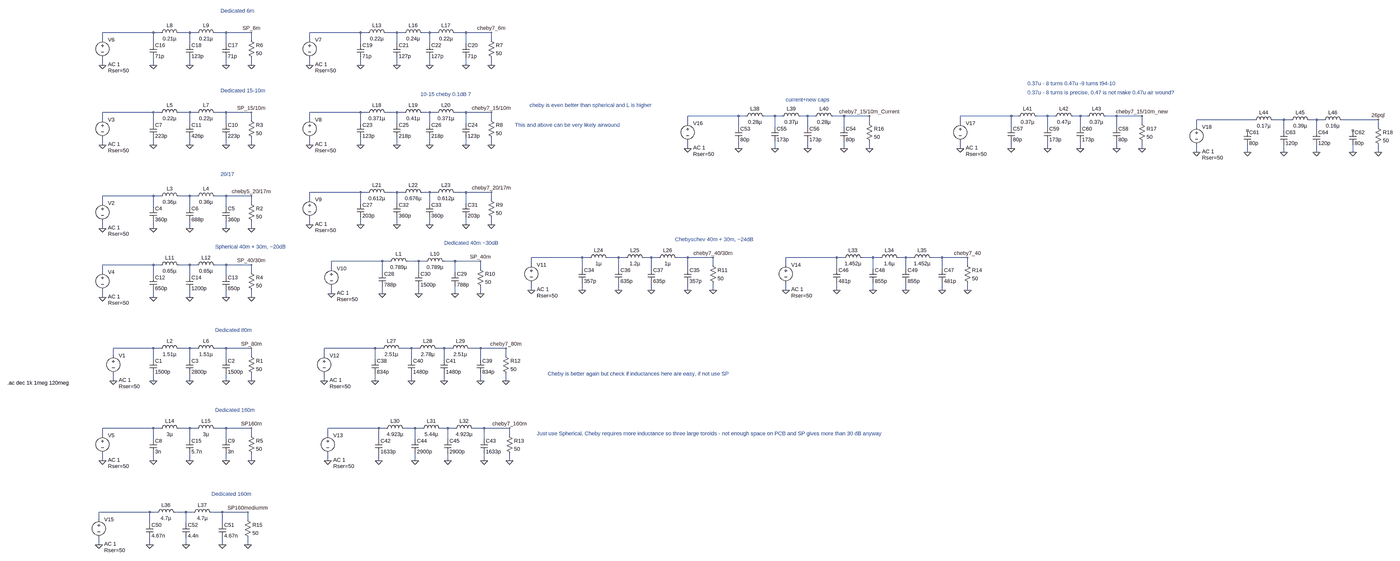
[diagram p0: schematic LPF.asc, whole sheet]
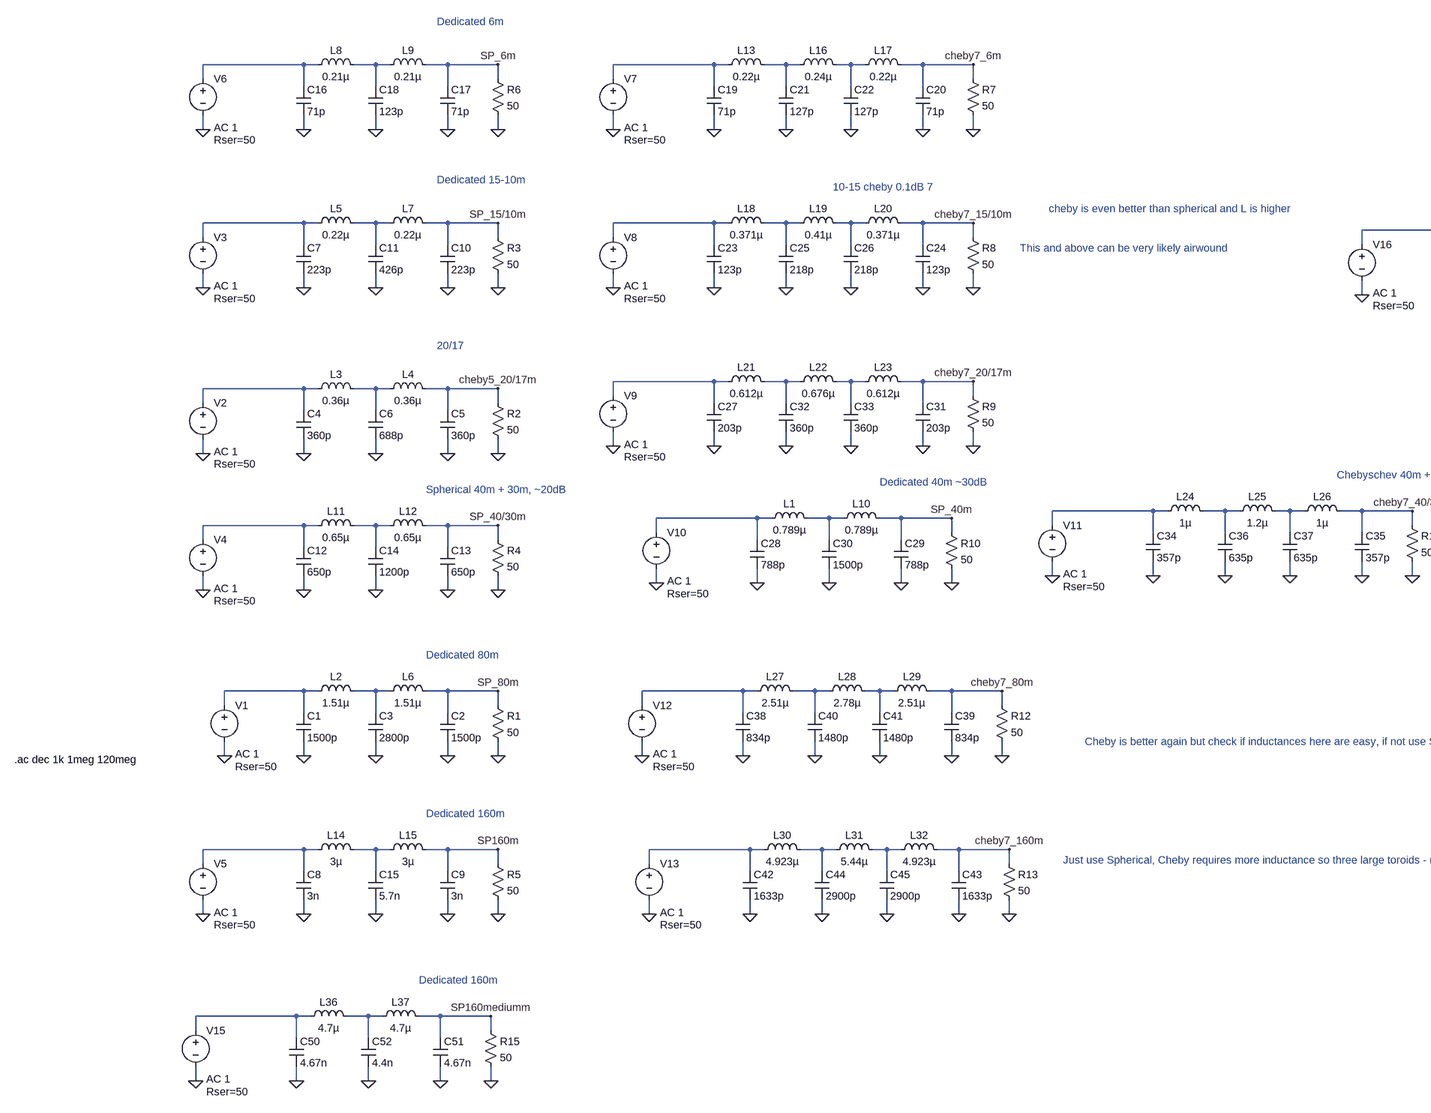
[diagram p1: schematic LPF.asc, part, row 1 of 1, column 1 of 2]
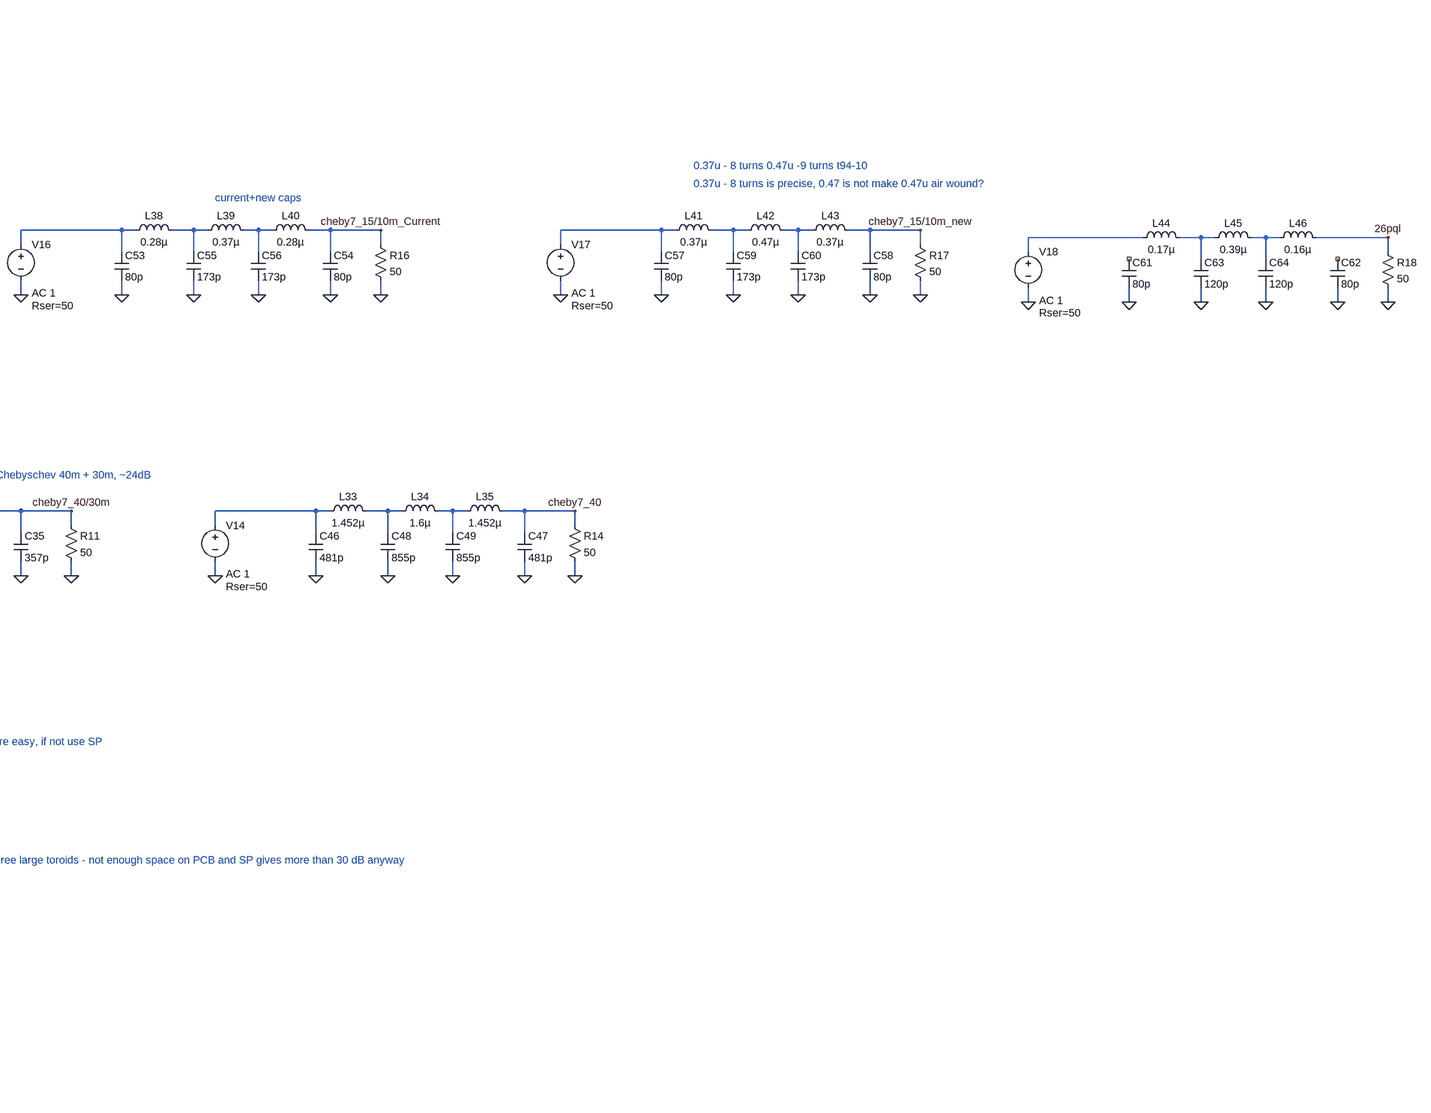
[diagram p2: schematic LPF.asc, part, row 1 of 1, column 2 of 2]
LPF.asc, the LTspice schematic file:
Version 4
SHEET 1 6016 728
WIRE 480 -1584 256 -1584
WIRE 512 -1584 480 -1584
WIRE 640 -1584 592 -1584
WIRE 672 -1584 640 -1584
WIRE 800 -1584 752 -1584
WIRE 912 -1584 800 -1584
WIRE 1392 -1584 1168 -1584
WIRE 1424 -1584 1392 -1584
WIRE 1552 -1584 1504 -1584
WIRE 1584 -1584 1552 -1584
WIRE 1696 -1584 1664 -1584
WIRE 1728 -1584 1696 -1584
WIRE 1856 -1584 1808 -1584
WIRE 1968 -1584 1856 -1584
WIRE 256 -1552 256 -1584
WIRE 912 -1552 912 -1584
WIRE 1168 -1552 1168 -1584
WIRE 1968 -1552 1968 -1584
WIRE 480 -1536 480 -1584
WIRE 640 -1536 640 -1584
WIRE 800 -1536 800 -1584
WIRE 1392 -1536 1392 -1584
WIRE 1552 -1536 1552 -1584
WIRE 1696 -1536 1696 -1584
WIRE 1856 -1536 1856 -1584
WIRE 256 -1440 256 -1472
WIRE 480 -1440 480 -1472
WIRE 640 -1440 640 -1472
WIRE 800 -1440 800 -1472
WIRE 912 -1440 912 -1472
WIRE 1168 -1440 1168 -1472
WIRE 1392 -1440 1392 -1472
WIRE 1552 -1440 1552 -1472
WIRE 1696 -1440 1696 -1472
WIRE 1856 -1440 1856 -1472
WIRE 1968 -1440 1968 -1472
WIRE 480 -1232 256 -1232
WIRE 512 -1232 480 -1232
WIRE 640 -1232 592 -1232
WIRE 672 -1232 640 -1232
WIRE 800 -1232 752 -1232
WIRE 912 -1232 800 -1232
WIRE 1392 -1232 1168 -1232
WIRE 1424 -1232 1392 -1232
WIRE 1552 -1232 1504 -1232
WIRE 1584 -1232 1552 -1232
WIRE 1696 -1232 1664 -1232
WIRE 1728 -1232 1696 -1232
WIRE 1856 -1232 1808 -1232
WIRE 1968 -1232 1856 -1232
WIRE 3056 -1216 2832 -1216
WIRE 3088 -1216 3056 -1216
WIRE 3216 -1216 3168 -1216
WIRE 3248 -1216 3216 -1216
WIRE 3360 -1216 3328 -1216
WIRE 3392 -1216 3360 -1216
WIRE 3520 -1216 3472 -1216
WIRE 3632 -1216 3520 -1216
WIRE 4256 -1216 4032 -1216
WIRE 4288 -1216 4256 -1216
WIRE 4416 -1216 4368 -1216
WIRE 4448 -1216 4416 -1216
WIRE 4560 -1216 4528 -1216
WIRE 4592 -1216 4560 -1216
WIRE 4720 -1216 4672 -1216
WIRE 4832 -1216 4720 -1216
WIRE 256 -1200 256 -1232
WIRE 912 -1200 912 -1232
WIRE 1168 -1200 1168 -1232
WIRE 1968 -1200 1968 -1232
WIRE 5328 -1200 5072 -1200
WIRE 5456 -1200 5408 -1200
WIRE 5488 -1200 5456 -1200
WIRE 5600 -1200 5568 -1200
WIRE 5632 -1200 5600 -1200
WIRE 5872 -1200 5712 -1200
WIRE 480 -1184 480 -1232
WIRE 640 -1184 640 -1232
WIRE 800 -1184 800 -1232
WIRE 1392 -1184 1392 -1232
WIRE 1552 -1184 1552 -1232
WIRE 1696 -1184 1696 -1232
WIRE 1856 -1184 1856 -1232
WIRE 2832 -1184 2832 -1216
WIRE 3632 -1184 3632 -1216
WIRE 4032 -1184 4032 -1216
WIRE 4832 -1184 4832 -1216
WIRE 3056 -1168 3056 -1216
WIRE 3216 -1168 3216 -1216
WIRE 3360 -1168 3360 -1216
WIRE 3520 -1168 3520 -1216
WIRE 4256 -1168 4256 -1216
WIRE 4416 -1168 4416 -1216
WIRE 4560 -1168 4560 -1216
WIRE 4720 -1168 4720 -1216
WIRE 5072 -1168 5072 -1200
WIRE 5872 -1168 5872 -1200
WIRE 5456 -1152 5456 -1200
WIRE 5600 -1152 5600 -1200
WIRE 256 -1088 256 -1120
WIRE 480 -1088 480 -1120
WIRE 640 -1088 640 -1120
WIRE 800 -1088 800 -1120
WIRE 912 -1088 912 -1120
WIRE 1168 -1088 1168 -1120
WIRE 1392 -1088 1392 -1120
WIRE 1552 -1088 1552 -1120
WIRE 1696 -1088 1696 -1120
WIRE 1856 -1088 1856 -1120
WIRE 1968 -1088 1968 -1120
WIRE 2832 -1072 2832 -1104
WIRE 3056 -1072 3056 -1104
WIRE 3216 -1072 3216 -1104
WIRE 3360 -1072 3360 -1104
WIRE 3520 -1072 3520 -1104
WIRE 3632 -1072 3632 -1104
WIRE 4032 -1072 4032 -1104
WIRE 4256 -1072 4256 -1104
WIRE 4416 -1072 4416 -1104
WIRE 4560 -1072 4560 -1104
WIRE 4720 -1072 4720 -1104
WIRE 4832 -1072 4832 -1104
WIRE 5072 -1056 5072 -1088
WIRE 5296 -1056 5296 -1088
WIRE 5456 -1056 5456 -1088
WIRE 5600 -1056 5600 -1088
WIRE 5760 -1056 5760 -1088
WIRE 5872 -1056 5872 -1088
WIRE 1392 -880 1168 -880
WIRE 1424 -880 1392 -880
WIRE 1552 -880 1504 -880
WIRE 1584 -880 1552 -880
WIRE 1696 -880 1664 -880
WIRE 1728 -880 1696 -880
WIRE 1856 -880 1808 -880
WIRE 1968 -880 1856 -880
WIRE 480 -864 256 -864
WIRE 512 -864 480 -864
WIRE 640 -864 592 -864
WIRE 672 -864 640 -864
WIRE 800 -864 752 -864
WIRE 912 -864 800 -864
WIRE 1168 -848 1168 -880
WIRE 1968 -848 1968 -880
WIRE 256 -832 256 -864
WIRE 912 -832 912 -864
WIRE 1392 -832 1392 -880
WIRE 1552 -832 1552 -880
WIRE 1696 -832 1696 -880
WIRE 1856 -832 1856 -880
WIRE 480 -816 480 -864
WIRE 640 -816 640 -864
WIRE 800 -816 800 -864
WIRE 1168 -736 1168 -768
WIRE 1392 -736 1392 -768
WIRE 1552 -736 1552 -768
WIRE 1696 -736 1696 -768
WIRE 1856 -736 1856 -768
WIRE 1968 -736 1968 -768
WIRE 256 -720 256 -752
WIRE 480 -720 480 -752
WIRE 640 -720 640 -752
WIRE 800 -720 800 -752
WIRE 912 -720 912 -752
WIRE 2368 -592 2144 -592
WIRE 2400 -592 2368 -592
WIRE 2528 -592 2480 -592
WIRE 2560 -592 2528 -592
WIRE 2672 -592 2640 -592
WIRE 2704 -592 2672 -592
WIRE 2832 -592 2784 -592
WIRE 2944 -592 2832 -592
WIRE 3488 -592 3264 -592
WIRE 3520 -592 3488 -592
WIRE 3648 -592 3600 -592
WIRE 3680 -592 3648 -592
WIRE 3792 -592 3760 -592
WIRE 3824 -592 3792 -592
WIRE 3952 -592 3904 -592
WIRE 4064 -592 3952 -592
WIRE 1488 -576 1264 -576
WIRE 1520 -576 1488 -576
WIRE 1648 -576 1600 -576
WIRE 1680 -576 1648 -576
WIRE 1808 -576 1760 -576
WIRE 1920 -576 1808 -576
WIRE 480 -560 256 -560
WIRE 512 -560 480 -560
WIRE 640 -560 592 -560
WIRE 672 -560 640 -560
WIRE 800 -560 752 -560
WIRE 912 -560 800 -560
WIRE 2144 -560 2144 -592
WIRE 2944 -560 2944 -592
WIRE 3264 -560 3264 -592
WIRE 4064 -560 4064 -592
WIRE 1264 -544 1264 -576
WIRE 1920 -544 1920 -576
WIRE 2368 -544 2368 -592
WIRE 2528 -544 2528 -592
WIRE 2672 -544 2672 -592
WIRE 2832 -544 2832 -592
WIRE 3488 -544 3488 -592
WIRE 3648 -544 3648 -592
WIRE 3792 -544 3792 -592
WIRE 3952 -544 3952 -592
WIRE 256 -528 256 -560
WIRE 912 -528 912 -560
WIRE 1488 -528 1488 -576
WIRE 1648 -528 1648 -576
WIRE 1808 -528 1808 -576
WIRE 480 -512 480 -560
WIRE 640 -512 640 -560
WIRE 800 -512 800 -560
WIRE 2144 -448 2144 -480
WIRE 2368 -448 2368 -480
WIRE 2528 -448 2528 -480
WIRE 2672 -448 2672 -480
WIRE 2832 -448 2832 -480
WIRE 2944 -448 2944 -480
WIRE 3264 -448 3264 -480
WIRE 3488 -448 3488 -480
WIRE 3648 -448 3648 -480
WIRE 3792 -448 3792 -480
WIRE 3952 -448 3952 -480
WIRE 4064 -448 4064 -480
WIRE 1264 -432 1264 -464
WIRE 1488 -432 1488 -464
WIRE 1648 -432 1648 -464
WIRE 1808 -432 1808 -464
WIRE 1920 -432 1920 -464
WIRE 256 -416 256 -448
WIRE 480 -416 480 -448
WIRE 640 -416 640 -448
WIRE 800 -416 800 -448
WIRE 912 -416 912 -448
WIRE 480 -192 304 -192
WIRE 512 -192 480 -192
WIRE 640 -192 592 -192
WIRE 672 -192 640 -192
WIRE 800 -192 752 -192
WIRE 912 -192 800 -192
WIRE 1456 -192 1232 -192
WIRE 1488 -192 1456 -192
WIRE 1616 -192 1568 -192
WIRE 1648 -192 1616 -192
WIRE 1760 -192 1728 -192
WIRE 1792 -192 1760 -192
WIRE 1920 -192 1872 -192
WIRE 2032 -192 1920 -192
WIRE 304 -160 304 -192
WIRE 912 -160 912 -192
WIRE 1232 -160 1232 -192
WIRE 2032 -160 2032 -192
WIRE 480 -144 480 -192
WIRE 640 -144 640 -192
WIRE 800 -144 800 -192
WIRE 1456 -144 1456 -192
WIRE 1616 -144 1616 -192
WIRE 1760 -144 1760 -192
WIRE 1920 -144 1920 -192
WIRE 304 -48 304 -80
WIRE 480 -48 480 -80
WIRE 640 -48 640 -80
WIRE 800 -48 800 -80
WIRE 912 -48 912 -80
WIRE 1232 -48 1232 -80
WIRE 1456 -48 1456 -80
WIRE 1616 -48 1616 -80
WIRE 1760 -48 1760 -80
WIRE 1920 -48 1920 -80
WIRE 2032 -48 2032 -80
WIRE 480 160 256 160
WIRE 512 160 480 160
WIRE 640 160 592 160
WIRE 672 160 640 160
WIRE 800 160 752 160
WIRE 912 160 800 160
WIRE 1472 160 1248 160
WIRE 1504 160 1472 160
WIRE 1632 160 1584 160
WIRE 1664 160 1632 160
WIRE 1776 160 1744 160
WIRE 1808 160 1776 160
WIRE 1936 160 1888 160
WIRE 2048 160 1936 160
WIRE 256 192 256 160
WIRE 912 192 912 160
WIRE 1248 192 1248 160
WIRE 2048 192 2048 160
WIRE 480 208 480 160
WIRE 640 208 640 160
WIRE 800 208 800 160
WIRE 1472 208 1472 160
WIRE 1632 208 1632 160
WIRE 1776 208 1776 160
WIRE 1936 208 1936 160
WIRE 256 304 256 272
WIRE 480 304 480 272
WIRE 640 304 640 272
WIRE 800 304 800 272
WIRE 912 304 912 272
WIRE 1248 304 1248 272
WIRE 1472 304 1472 272
WIRE 1632 304 1632 272
WIRE 1776 304 1776 272
WIRE 1936 304 1936 272
WIRE 2048 304 2048 272
WIRE 464 544 240 544
WIRE 496 544 464 544
WIRE 624 544 576 544
WIRE 656 544 624 544
WIRE 784 544 736 544
WIRE 896 544 784 544
WIRE 240 576 240 544
WIRE 896 576 896 544
WIRE 464 592 464 544
WIRE 624 592 624 544
WIRE 784 592 784 544
WIRE 240 688 240 656
WIRE 464 688 464 656
WIRE 624 688 624 656
WIRE 784 688 784 656
WIRE 896 688 896 656
FLAG 912 -416 0
FLAG 800 -416 0
FLAG 480 -416 0
FLAG 256 -416 0
FLAG 640 -416 0
FLAG 912 -560 SP_40/30m
FLAG 912 -48 0
FLAG 800 -48 0
FLAG 480 -48 0
FLAG 304 -48 0
FLAG 640 -48 0
FLAG 912 -192 SP_80m
FLAG 912 304 0
FLAG 800 304 0
FLAG 480 304 0
FLAG 256 304 0
FLAG 640 304 0
FLAG 912 160 SP160m
FLAG 1920 -432 0
FLAG 1808 -432 0
FLAG 1488 -432 0
FLAG 1264 -432 0
FLAG 1648 -432 0
FLAG 1920 -576 SP_40m
FLAG 912 -720 0
FLAG 800 -720 0
FLAG 480 -720 0
FLAG 256 -720 0
FLAG 640 -720 0
FLAG 912 -864 cheby5_20/17m
FLAG 912 -1088 0
FLAG 800 -1088 0
FLAG 480 -1088 0
FLAG 256 -1088 0
FLAG 640 -1088 0
FLAG 912 -1232 SP_15/10m
FLAG 912 -1440 0
FLAG 800 -1440 0
FLAG 480 -1440 0
FLAG 256 -1440 0
FLAG 640 -1440 0
FLAG 912 -1584 SP_6m
FLAG 1968 -1440 0
FLAG 1856 -1440 0
FLAG 1392 -1440 0
FLAG 1168 -1440 0
FLAG 1552 -1440 0
FLAG 1968 -1584 cheby7_6m
FLAG 1696 -1440 0
FLAG 1968 -1088 0
FLAG 1856 -1088 0
FLAG 1392 -1088 0
FLAG 1168 -1088 0
FLAG 1552 -1088 0
FLAG 1968 -1232 cheby7_15/10m
FLAG 1696 -1088 0
FLAG 1968 -736 0
FLAG 1856 -736 0
FLAG 1392 -736 0
FLAG 1168 -736 0
FLAG 1552 -736 0
FLAG 1968 -880 cheby7_20/17m
FLAG 1696 -736 0
FLAG 2944 -448 0
FLAG 2832 -448 0
FLAG 2368 -448 0
FLAG 2144 -448 0
FLAG 2528 -448 0
FLAG 2944 -592 cheby7_40/30m
FLAG 2672 -448 0
FLAG 2032 -48 0
FLAG 1920 -48 0
FLAG 1456 -48 0
FLAG 1232 -48 0
FLAG 1616 -48 0
FLAG 2032 -192 cheby7_80m
FLAG 1760 -48 0
FLAG 2048 304 0
FLAG 1936 304 0
FLAG 1472 304 0
FLAG 1248 304 0
FLAG 1632 304 0
FLAG 2048 160 cheby7_160m
FLAG 1776 304 0
FLAG 4064 -448 0
FLAG 3952 -448 0
FLAG 3488 -448 0
FLAG 3264 -448 0
FLAG 3648 -448 0
FLAG 4064 -592 cheby7_40
FLAG 3792 -448 0
FLAG 896 688 0
FLAG 784 688 0
FLAG 464 688 0
FLAG 240 688 0
FLAG 624 688 0
FLAG 896 544 SP160mediumm
FLAG 3632 -1072 0
FLAG 3520 -1072 0
FLAG 3056 -1072 0
FLAG 2832 -1072 0
FLAG 3216 -1072 0
FLAG 3632 -1216 cheby7_15/10m_Current
FLAG 3360 -1072 0
FLAG 4832 -1072 0
FLAG 4720 -1072 0
FLAG 4256 -1072 0
FLAG 4032 -1072 0
FLAG 4416 -1072 0
FLAG 4832 -1216 cheby7_15/10m_new
FLAG 4560 -1072 0
FLAG 5872 -1056 0
FLAG 5760 -1056 0
FLAG 5296 -1056 0
FLAG 5072 -1056 0
FLAG 5456 -1056 0
FLAG 5872 -1200 26pql
FLAG 5600 -1056 0
SYMBOL ind 496 -544 R270
WINDOW 0 32 56 VTop 2
WINDOW 3 5 56 VBottom 2
SYMATTR InstName L11
SYMATTR Value 0.65µ
SYMBOL cap 464 -512 R0
SYMATTR InstName C12
SYMATTR Value 650p
SYMBOL cap 784 -512 R0
SYMATTR InstName C13
SYMATTR Value 650p
SYMBOL res 896 -544 R0
SYMATTR InstName R4
SYMATTR Value 50
SYMBOL voltage 256 -544 R0
WINDOW 123 24 124 Left 2
WINDOW 39 24 152 Left 2
SYMATTR Value2 AC 1
SYMATTR SpiceLine Rser=50
SYMATTR InstName V4
SYMATTR Value ""
SYMBOL ind 656 -544 R270
WINDOW 0 32 56 VTop 2
WINDOW 3 5 56 VBottom 2
SYMATTR InstName L12
SYMATTR Value 0.65µ
SYMBOL cap 624 -512 R0
SYMATTR InstName C14
SYMATTR Value 1200p
SYMBOL ind 496 -176 R270
WINDOW 0 32 56 VTop 2
WINDOW 3 5 56 VBottom 2
SYMATTR InstName L2
SYMATTR Value 1.51µ
SYMBOL cap 464 -144 R0
SYMATTR InstName C1
SYMATTR Value 1500p
SYMBOL cap 784 -144 R0
SYMATTR InstName C2
SYMATTR Value 1500p
SYMBOL res 896 -176 R0
SYMATTR InstName R1
SYMATTR Value 50
SYMBOL voltage 304 -176 R0
WINDOW 123 24 124 Left 2
WINDOW 39 24 152 Left 2
SYMATTR Value2 AC 1
SYMATTR SpiceLine Rser=50
SYMATTR InstName V1
SYMATTR Value ""
SYMBOL ind 656 -176 R270
WINDOW 0 32 56 VTop 2
WINDOW 3 5 56 VBottom 2
SYMATTR InstName L6
SYMATTR Value 1.51µ
SYMBOL cap 624 -144 R0
SYMATTR InstName C3
SYMATTR Value 2800p
SYMBOL ind 496 176 R270
WINDOW 0 32 56 VTop 2
WINDOW 3 5 56 VBottom 2
SYMATTR InstName L14
SYMATTR Value 3µ
SYMATTR SpiceLine Rser=0.08
SYMBOL cap 464 208 R0
SYMATTR InstName C8
SYMATTR Value 3n
SYMBOL cap 784 208 R0
SYMATTR InstName C9
SYMATTR Value 3n
SYMBOL res 896 176 R0
SYMATTR InstName R5
SYMATTR Value 50
SYMBOL voltage 256 176 R0
WINDOW 123 24 124 Left 2
WINDOW 39 24 152 Left 2
SYMATTR Value2 AC 1
SYMATTR SpiceLine Rser=50
SYMATTR InstName V5
SYMATTR Value ""
SYMBOL ind 656 176 R270
WINDOW 0 32 56 VTop 2
WINDOW 3 5 56 VBottom 2
SYMATTR InstName L15
SYMATTR Value 3µ
SYMATTR SpiceLine Rser=0.08
SYMBOL cap 624 208 R0
SYMATTR InstName C15
SYMATTR Value 5.7n
SYMBOL ind 1504 -560 R270
WINDOW 0 32 56 VTop 2
WINDOW 3 5 56 VBottom 2
SYMATTR InstName L1
SYMATTR Value 0.789µ
SYMBOL cap 1472 -528 R0
SYMATTR InstName C28
SYMATTR Value 788p
SYMBOL cap 1792 -528 R0
SYMATTR InstName C29
SYMATTR Value 788p
SYMBOL res 1904 -560 R0
SYMATTR InstName R10
SYMATTR Value 50
SYMBOL voltage 1264 -560 R0
WINDOW 123 24 124 Left 2
WINDOW 39 24 152 Left 2
SYMATTR Value2 AC 1
SYMATTR SpiceLine Rser=50
SYMATTR InstName V10
SYMATTR Value ""
SYMBOL ind 1664 -560 R270
WINDOW 0 32 56 VTop 2
WINDOW 3 5 56 VBottom 2
SYMATTR InstName L10
SYMATTR Value 0.789µ
SYMBOL cap 1632 -528 R0
SYMATTR InstName C30
SYMATTR Value 1500p
SYMBOL ind 496 -848 R270
WINDOW 0 32 56 VTop 2
WINDOW 3 5 56 VBottom 2
SYMATTR InstName L3
SYMATTR Value 0.36µ
SYMBOL cap 464 -816 R0
SYMATTR InstName C4
SYMATTR Value 360p
SYMBOL cap 784 -816 R0
SYMATTR InstName C5
SYMATTR Value 360p
SYMBOL res 896 -848 R0
SYMATTR InstName R2
SYMATTR Value 50
SYMBOL voltage 256 -848 R0
WINDOW 123 24 124 Left 2
WINDOW 39 24 152 Left 2
SYMATTR Value2 AC 1
SYMATTR SpiceLine Rser=50
SYMATTR InstName V2
SYMATTR Value ""
SYMBOL ind 656 -848 R270
WINDOW 0 32 56 VTop 2
WINDOW 3 5 56 VBottom 2
SYMATTR InstName L4
SYMATTR Value 0.36µ
SYMBOL cap 624 -816 R0
SYMATTR InstName C6
SYMATTR Value 688p
SYMBOL ind 496 -1216 R270
WINDOW 0 32 56 VTop 2
WINDOW 3 5 56 VBottom 2
SYMATTR InstName L5
SYMATTR Value 0.22µ
SYMBOL cap 464 -1184 R0
SYMATTR InstName C7
SYMATTR Value 223p
SYMBOL cap 784 -1184 R0
SYMATTR InstName C10
SYMATTR Value 223p
SYMBOL res 896 -1216 R0
SYMATTR InstName R3
SYMATTR Value 50
SYMBOL voltage 256 -1216 R0
WINDOW 123 24 124 Left 2
WINDOW 39 24 152 Left 2
SYMATTR Value2 AC 1
SYMATTR SpiceLine Rser=50
SYMATTR InstName V3
SYMATTR Value ""
SYMBOL ind 656 -1216 R270
WINDOW 0 32 56 VTop 2
WINDOW 3 5 56 VBottom 2
SYMATTR InstName L7
SYMATTR Value 0.22µ
SYMBOL cap 624 -1184 R0
SYMATTR InstName C11
SYMATTR Value 426p
SYMBOL ind 496 -1568 R270
WINDOW 0 32 56 VTop 2
WINDOW 3 5 56 VBottom 2
SYMATTR InstName L8
SYMATTR Value 0.21µ
SYMBOL cap 464 -1536 R0
SYMATTR InstName C16
SYMATTR Value 71p
SYMBOL cap 784 -1536 R0
SYMATTR InstName C17
SYMATTR Value 71p
SYMBOL res 896 -1568 R0
SYMATTR InstName R6
SYMATTR Value 50
SYMBOL voltage 256 -1568 R0
WINDOW 123 24 124 Left 2
WINDOW 39 24 152 Left 2
SYMATTR Value2 AC 1
SYMATTR SpiceLine Rser=50
SYMATTR InstName V6
SYMATTR Value ""
SYMBOL ind 656 -1568 R270
WINDOW 0 32 56 VTop 2
WINDOW 3 5 56 VBottom 2
SYMATTR InstName L9
SYMATTR Value 0.21µ
SYMBOL cap 624 -1536 R0
SYMATTR InstName C18
SYMATTR Value 123p
SYMBOL ind 1408 -1568 R270
WINDOW 0 32 56 VTop 2
WINDOW 3 5 56 VBottom 2
SYMATTR InstName L13
SYMATTR Value 0.22µ
SYMBOL cap 1376 -1536 R0
SYMATTR InstName C19
SYMATTR Value 71p
SYMBOL cap 1840 -1536 R0
SYMATTR InstName C20
SYMATTR Value 71p
SYMBOL res 1952 -1568 R0
SYMATTR InstName R7
SYMATTR Value 50
SYMBOL voltage 1168 -1568 R0
WINDOW 123 24 124 Left 2
WINDOW 39 24 152 Left 2
SYMATTR Value2 AC 1
SYMATTR SpiceLine Rser=50
SYMATTR InstName V7
SYMATTR Value ""
SYMBOL ind 1568 -1568 R270
WINDOW 0 32 56 VTop 2
WINDOW 3 5 56 VBottom 2
SYMATTR InstName L16
SYMATTR Value 0.24µ
SYMBOL cap 1536 -1536 R0
SYMATTR InstName C21
SYMATTR Value 127p
SYMBOL ind 1712 -1568 R270
WINDOW 0 32 56 VTop 2
WINDOW 3 5 56 VBottom 2
SYMATTR InstName L17
SYMATTR Value 0.22µ
SYMBOL cap 1680 -1536 R0
SYMATTR InstName C22
SYMATTR Value 127p
SYMBOL ind 1408 -1216 R270
WINDOW 0 32 56 VTop 2
WINDOW 3 5 56 VBottom 2
SYMATTR InstName L18
SYMATTR Value 0.371µ
SYMBOL cap 1376 -1184 R0
SYMATTR InstName C23
SYMATTR Value 123p
SYMBOL cap 1840 -1184 R0
SYMATTR InstName C24
SYMATTR Value 123p
SYMBOL res 1952 -1216 R0
SYMATTR InstName R8
SYMATTR Value 50
SYMBOL voltage 1168 -1216 R0
WINDOW 123 24 124 Left 2
WINDOW 39 24 152 Left 2
SYMATTR Value2 AC 1
SYMATTR SpiceLine Rser=50
SYMATTR InstName V8
SYMATTR Value ""
SYMBOL ind 1568 -1216 R270
WINDOW 0 32 56 VTop 2
WINDOW 3 5 56 VBottom 2
SYMATTR InstName L19
SYMATTR Value 0.41µ
SYMBOL cap 1536 -1184 R0
SYMATTR InstName C25
SYMATTR Value 218p
SYMBOL ind 1712 -1216 R270
WINDOW 0 32 56 VTop 2
WINDOW 3 5 56 VBottom 2
SYMATTR InstName L20
SYMATTR Value 0.371µ
SYMBOL cap 1680 -1184 R0
SYMATTR InstName C26
SYMATTR Value 218p
SYMBOL ind 1408 -864 R270
WINDOW 0 32 56 VTop 2
WINDOW 3 5 56 VBottom 2
SYMATTR InstName L21
SYMATTR Value 0.612µ
SYMBOL cap 1376 -832 R0
SYMATTR InstName C27
SYMATTR Value 203p
SYMBOL cap 1840 -832 R0
SYMATTR InstName C31
SYMATTR Value 203p
SYMBOL res 1952 -864 R0
SYMATTR InstName R9
SYMATTR Value 50
SYMBOL voltage 1168 -864 R0
WINDOW 123 24 124 Left 2
WINDOW 39 24 152 Left 2
SYMATTR Value2 AC 1
SYMATTR SpiceLine Rser=50
SYMATTR InstName V9
SYMATTR Value ""
SYMBOL ind 1568 -864 R270
WINDOW 0 32 56 VTop 2
WINDOW 3 5 56 VBottom 2
SYMATTR InstName L22
SYMATTR Value 0.676µ
SYMBOL cap 1536 -832 R0
SYMATTR InstName C32
SYMATTR Value 360p
SYMBOL ind 1712 -864 R270
WINDOW 0 32 56 VTop 2
WINDOW 3 5 56 VBottom 2
SYMATTR InstName L23
SYMATTR Value 0.612µ
SYMBOL cap 1680 -832 R0
SYMATTR InstName C33
SYMATTR Value 360p
SYMBOL ind 2384 -576 R270
WINDOW 0 32 56 VTop 2
WINDOW 3 5 56 VBottom 2
SYMATTR InstName L24
SYMATTR Value 1µ
SYMBOL cap 2352 -544 R0
SYMATTR InstName C34
SYMATTR Value 357p
SYMBOL cap 2816 -544 R0
SYMATTR InstName C35
SYMATTR Value 357p
SYMBOL res 2928 -576 R0
SYMATTR InstName R11
SYMATTR Value 50
SYMBOL voltage 2144 -576 R0
WINDOW 123 24 124 Left 2
WINDOW 39 24 152 Left 2
SYMATTR Value2 AC 1
SYMATTR SpiceLine Rser=50
SYMATTR InstName V11
SYMATTR Value ""
SYMBOL ind 2544 -576 R270
WINDOW 0 32 56 VTop 2
WINDOW 3 5 56 VBottom 2
SYMATTR InstName L25
SYMATTR Value 1.2µ
SYMBOL cap 2512 -544 R0
SYMATTR InstName C36
SYMATTR Value 635p
SYMBOL ind 2688 -576 R270
WINDOW 0 32 56 VTop 2
WINDOW 3 5 56 VBottom 2
SYMATTR InstName L26
SYMATTR Value 1µ
SYMBOL cap 2656 -544 R0
SYMATTR InstName C37
SYMATTR Value 635p
SYMBOL ind 1472 -176 R270
WINDOW 0 32 56 VTop 2
WINDOW 3 5 56 VBottom 2
SYMATTR InstName L27
SYMATTR Value 2.51µ
SYMBOL cap 1440 -144 R0
SYMATTR InstName C38
SYMATTR Value 834p
SYMBOL cap 1904 -144 R0
SYMATTR InstName C39
SYMATTR Value 834p
SYMBOL res 2016 -176 R0
SYMATTR InstName R12
SYMATTR Value 50
SYMBOL voltage 1232 -176 R0
WINDOW 123 24 124 Left 2
WINDOW 39 24 152 Left 2
SYMATTR Value2 AC 1
SYMATTR SpiceLine Rser=50
SYMATTR InstName V12
SYMATTR Value ""
SYMBOL ind 1632 -176 R270
WINDOW 0 32 56 VTop 2
WINDOW 3 5 56 VBottom 2
SYMATTR InstName L28
SYMATTR Value 2.78µ
SYMBOL cap 1600 -144 R0
SYMATTR InstName C40
SYMATTR Value 1480p
SYMBOL ind 1776 -176 R270
WINDOW 0 32 56 VTop 2
WINDOW 3 5 56 VBottom 2
SYMATTR InstName L29
SYMATTR Value 2.51µ
SYMBOL cap 1744 -144 R0
SYMATTR InstName C41
SYMATTR Value 1480p
SYMBOL ind 1488 176 R270
WINDOW 0 32 56 VTop 2
WINDOW 3 5 56 VBottom 2
SYMATTR InstName L30
SYMATTR Value 4.923µ
SYMATTR SpiceLine Rser=0.08
SYMBOL cap 1456 208 R0
SYMATTR InstName C42
SYMATTR Value 1633p
SYMBOL cap 1920 208 R0
SYMATTR InstName C43
SYMATTR Value 1633p
SYMBOL res 2032 176 R0
SYMATTR InstName R13
SYMATTR Value 50
SYMBOL voltage 1248 176 R0
WINDOW 123 24 124 Left 2
WINDOW 39 24 152 Left 2
SYMATTR Value2 AC 1
SYMATTR SpiceLine Rser=50
SYMATTR InstName V13
SYMATTR Value ""
SYMBOL ind 1648 176 R270
WINDOW 0 32 56 VTop 2
WINDOW 3 5 56 VBottom 2
SYMATTR InstName L31
SYMATTR Value 5.44µ
SYMATTR SpiceLine Rser=0.08
SYMBOL cap 1616 208 R0
SYMATTR InstName C44
SYMATTR Value 2900p
SYMBOL ind 1792 176 R270
WINDOW 0 32 56 VTop 2
WINDOW 3 5 56 VBottom 2
SYMATTR InstName L32
SYMATTR Value 4.923µ
SYMATTR SpiceLine Rser=0.08
SYMBOL cap 1760 208 R0
SYMATTR InstName C45
SYMATTR Value 2900p
SYMBOL ind 3504 -576 R270
WINDOW 0 32 56 VTop 2
WINDOW 3 5 56 VBottom 2
SYMATTR InstName L33
SYMATTR Value 1.452µ
SYMBOL cap 3472 -544 R0
SYMATTR InstName C46
SYMATTR Value 481p
SYMBOL cap 3936 -544 R0
SYMATTR InstName C47
SYMATTR Value 481p
SYMBOL res 4048 -576 R0
SYMATTR InstName R14
SYMATTR Value 50
SYMBOL voltage 3264 -576 R0
WINDOW 123 24 124 Left 2
WINDOW 39 24 152 Left 2
SYMATTR Value2 AC 1
SYMATTR SpiceLine Rser=50
SYMATTR InstName V14
SYMATTR Value ""
SYMBOL ind 3664 -576 R270
WINDOW 0 32 56 VTop 2
WINDOW 3 5 56 VBottom 2
SYMATTR InstName L34
SYMATTR Value 1.6µ
SYMBOL cap 3632 -544 R0
SYMATTR InstName C48
SYMATTR Value 855p
SYMBOL ind 3808 -576 R270
WINDOW 0 32 56 VTop 2
WINDOW 3 5 56 VBottom 2
SYMATTR InstName L35
SYMATTR Value 1.452µ
SYMBOL cap 3776 -544 R0
SYMATTR InstName C49
SYMATTR Value 855p
SYMBOL ind 480 560 R270
WINDOW 0 32 56 VTop 2
WINDOW 3 5 56 VBottom 2
SYMATTR InstName L36
SYMATTR Value 4.7µ
SYMATTR SpiceLine Rser=0.08
SYMBOL cap 448 592 R0
SYMATTR InstName C50
SYMATTR Value 4.67n
SYMBOL cap 768 592 R0
SYMATTR InstName C51
SYMATTR Value 4.67n
SYMBOL res 880 560 R0
SYMATTR InstName R15
SYMATTR Value 50
SYMBOL voltage 240 560 R0
WINDOW 123 24 124 Left 2
WINDOW 39 24 152 Left 2
SYMATTR Value2 AC 1
SYMATTR SpiceLine Rser=50
SYMATTR InstName V15
SYMATTR Value ""
SYMBOL ind 640 560 R270
WINDOW 0 32 56 VTop 2
WINDOW 3 5 56 VBottom 2
SYMATTR InstName L37
SYMATTR Value 4.7µ
SYMATTR SpiceLine Rser=0.08
SYMBOL cap 608 592 R0
SYMATTR InstName C52
SYMATTR Value 4.4n
SYMBOL ind 3072 -1200 R270
WINDOW 0 32 56 VTop 2
WINDOW 3 5 56 VBottom 2
SYMATTR InstName L38
SYMATTR Value 0.28µ
SYMBOL cap 3040 -1168 R0
SYMATTR InstName C53
SYMATTR Value 80p
SYMBOL cap 3504 -1168 R0
SYMATTR InstName C54
SYMATTR Value 80p
SYMBOL res 3616 -1200 R0
SYMATTR InstName R16
SYMATTR Value 50
SYMBOL voltage 2832 -1200 R0
WINDOW 123 24 124 Left 2
WINDOW 39 24 152 Left 2
SYMATTR Value2 AC 1
SYMATTR SpiceLine Rser=50
SYMATTR InstName V16
SYMATTR Value ""
SYMBOL ind 3232 -1200 R270
WINDOW 0 32 56 VTop 2
WINDOW 3 5 56 VBottom 2
SYMATTR InstName L39
SYMATTR Value 0.37µ
SYMBOL cap 3200 -1168 R0
SYMATTR InstName C55
SYMATTR Value 173p
SYMBOL ind 3376 -1200 R270
WINDOW 0 32 56 VTop 2
WINDOW 3 5 56 VBottom 2
SYMATTR InstName L40
SYMATTR Value 0.28µ
SYMBOL cap 3344 -1168 R0
SYMATTR InstName C56
SYMATTR Value 173p
SYMBOL ind 4272 -1200 R270
WINDOW 0 32 56 VTop 2
WINDOW 3 5 56 VBottom 2
SYMATTR InstName L41
SYMATTR Value 0.37µ
SYMBOL cap 4240 -1168 R0
SYMATTR InstName C57
SYMATTR Value 80p
SYMBOL cap 4704 -1168 R0
SYMATTR InstName C58
SYMATTR Value 80p
SYMBOL res 4816 -1200 R0
SYMATTR InstName R17
SYMATTR Value 50
SYMBOL voltage 4032 -1200 R0
WINDOW 123 24 124 Left 2
WINDOW 39 24 152 Left 2
SYMATTR Value2 AC 1
SYMATTR SpiceLine Rser=50
SYMATTR InstName V17
SYMATTR Value ""
SYMBOL ind 4432 -1200 R270
WINDOW 0 32 56 VTop 2
WINDOW 3 5 56 VBottom 2
SYMATTR InstName L42
SYMATTR Value 0.47µ
SYMBOL cap 4400 -1168 R0
SYMATTR InstName C59
SYMATTR Value 173p
SYMBOL ind 4576 -1200 R270
WINDOW 0 32 56 VTop 2
WINDOW 3 5 56 VBottom 2
SYMATTR InstName L43
SYMATTR Value 0.37µ
SYMBOL cap 4544 -1168 R0
SYMATTR InstName C60
SYMATTR Value 173p
SYMBOL ind 5312 -1184 R270
WINDOW 0 32 56 VTop 2
WINDOW 3 5 56 VBottom 2
SYMATTR InstName L44
SYMATTR Value 0.17µ
SYMBOL cap 5280 -1152 R0
SYMATTR InstName C61
SYMATTR Value 80p
SYMBOL cap 5744 -1152 R0
SYMATTR InstName C62
SYMATTR Value 80p
SYMBOL res 5856 -1184 R0
SYMATTR InstName R18
SYMATTR Value 50
SYMBOL voltage 5072 -1184 R0
WINDOW 123 24 124 Left 2
WINDOW 39 24 152 Left 2
SYMATTR Value2 AC 1
SYMATTR SpiceLine Rser=50
SYMATTR InstName V18
SYMATTR Value ""
SYMBOL ind 5472 -1184 R270
WINDOW 0 32 56 VTop 2
WINDOW 3 5 56 VBottom 2
SYMATTR InstName L45
SYMATTR Value 0.39µ
SYMBOL cap 5440 -1152 R0
SYMATTR InstName C63
SYMATTR Value 120p
SYMBOL ind 5616 -1184 R270
WINDOW 0 32 56 VTop 2
WINDOW 3 5 56 VBottom 2
SYMATTR InstName L46
SYMATTR Value 0.16µ
SYMBOL cap 5584 -1152 R0
SYMATTR InstName C64
SYMATTR Value 120p
TEXT -488 -40 Left 2 !.ac dec 1k 1meg 120meg
TEXT 752 -640 Left 2 ;Spherical 40m + 30m, ~20dB
TEXT 752 -272 Left 2 ;Dedicated 80m
TEXT 752 80 Left 2 ;Dedicated 160m
TEXT 776 -960 Left 2 ;20/17
TEXT 1760 -656 Left 2 ;Dedicated 40m ~30dB
TEXT 776 -1328 Left 2 ;Dedicated 15-10m
TEXT 776 -1680 Left 2 ;Dedicated 6m
TEXT 1656 -1312 Left 2 ;10-15 cheby 0.1dB 7
TEXT 2136 -1264 Left 2 ;cheby is even better than spherical and L is higher
TEXT 2072 -1176 Left 2 ;This and above can be very likely airwound
TEXT 2776 -672 Left 2 ;Chebyschev 40m + 30m, ~24dB
TEXT 2216 -80 Left 2 ;Cheby is better again but check if inductances here are easy, if not use SP
TEXT 2168 184 Left 2 ;Just use Spherical, Cheby requires more inductance so three large toroids - not enough space on PCB and SP gives more than 30 dB anyway
TEXT 736 464 Left 2 ;Dedicated 160m
TEXT 4328 -1360 Left 2 ;0.37u - 8 turns 0.47u -9 turns t94-10
TEXT 4328 -1320 Left 2 ;0.37u - 8 turns is precise, 0.47 is not make 0.47u air wound?
TEXT 3264 -1288 Left 2 ;current+new caps

The netlist it stands for:
* LPF.asc
L11 N033 N034 0.65µ
C12 N033 0 650p
C13 SP_40/30m 0 650p
R4 SP_40/30m 0 50
V4 N033 0 AC 1 Rser=50
L12 N034 SP_40/30m 0.65µ
C14 N034 0 1200p
L2 N035 N036 1.51µ
C1 N035 0 1500p
C2 SP_80m 0 1500p
R1 SP_80m 0 50
V1 N035 0 AC 1 Rser=50
L6 N036 SP_80m 1.51µ
C3 N036 0 2800p
L14 N040 N041 3µ Rser=0.08
C8 N040 0 3n
C9 SP160m 0 3n
R5 SP160m 0 50
V5 N040 0 AC 1 Rser=50
L15 N041 SP160m 3µ Rser=0.08
C15 N041 0 5.7n
L1 N031 N032 0.789µ
C28 N031 0 788p
C29 SP_40m 0 788p
R10 SP_40m 0 50
V10 N031 0 AC 1 Rser=50
L10 N032 SP_40m 0.789µ
C30 N032 0 1500p
L3 N023 N024 0.36µ
C4 N023 0 360p
C5 cheby5_20/17m 0 360p
R2 cheby5_20/17m 0 50
V2 N023 0 AC 1 Rser=50
L4 N024 cheby5_20/17m 0.36µ
C6 N024 0 688p
L5 N006 N007 0.22µ
C7 N006 0 223p
C10 SP_15/10m 0 223p
R3 SP_15/10m 0 50
V3 N006 0 AC 1 Rser=50
L7 N007 SP_15/10m 0.22µ
C11 N007 0 426p
L8 N001 N002 0.21µ
C16 N001 0 71p
C17 SP_6m 0 71p
R6 SP_6m 0 50
V6 N001 0 AC 1 Rser=50
L9 N002 SP_6m 0.21µ
C18 N002 0 123p
L13 N003 N004 0.22µ
C19 N003 0 71p
C20 cheby7_6m 0 71p
R7 cheby7_6m 0 50
V7 N003 0 AC 1 Rser=50
L16 N004 N005 0.24µ
C21 N004 0 127p
L17 N005 cheby7_6m 0.22µ
C22 N005 0 127p
L18 N008 N009 0.371µ
C23 N008 0 123p
C24 cheby7_15/10m 0 123p
R8 cheby7_15/10m 0 50
V8 N008 0 AC 1 Rser=50
L19 N009 N010 0.41µ
C25 N009 0 218p
L20 N010 cheby7_15/10m 0.371µ
C26 N010 0 218p
L21 N020 N021 0.612µ
C27 N020 0 203p
C31 cheby7_20/17m 0 203p
R9 cheby7_20/17m 0 50
V9 N020 0 AC 1 Rser=50
L22 N021 N022 0.676µ
C32 N021 0 360p
L23 N022 cheby7_20/17m 0.612µ
C33 N022 0 360p
L24 N025 N026 1µ
C34 N025 0 357p
C35 cheby7_40/30m 0 357p
R11 cheby7_40/30m 0 50
V11 N025 0 AC 1 Rser=50
L25 N026 N027 1.2µ
C36 N026 0 635p
L26 N027 cheby7_40/30m 1µ
C37 N027 0 635p
L27 N037 N038 2.51µ
C38 N037 0 834p
C39 cheby7_80m 0 834p
R12 cheby7_80m 0 50
V12 N037 0 AC 1 Rser=50
L28 N038 N039 2.78µ
C40 N038 0 1480p
L29 N039 cheby7_80m 2.51µ
C41 N039 0 1480p
L30 N042 N043 4.923µ Rser=0.08
C42 N042 0 1633p
C43 cheby7_160m 0 1633p
R13 cheby7_160m 0 50
V13 N042 0 AC 1 Rser=50
L31 N043 N044 5.44µ Rser=0.08
C44 N043 0 2900p
L32 N044 cheby7_160m 4.923µ Rser=0.08
C45 N044 0 2900p
L33 N028 N029 1.452µ
C46 N028 0 481p
C47 cheby7_40 0 481p
R14 cheby7_40 0 50
V14 N028 0 AC 1 Rser=50
L34 N029 N030 1.6µ
C48 N029 0 855p
L35 N030 cheby7_40 1.452µ
C49 N030 0 855p
L36 N045 N046 4.7µ Rser=0.08
C50 N045 0 4.67n
C51 SP160mediumm 0 4.67n
R15 SP160mediumm 0 50
V15 N045 0 AC 1 Rser=50
L37 N046 SP160mediumm 4.7µ Rser=0.08
C52 N046 0 4.4n
L38 N011 N012 0.28µ
C53 N011 0 80p
C54 cheby7_15/10m_Current 0 80p
R16 cheby7_15/10m_Current 0 50
V16 N011 0 AC 1 Rser=50
L39 N012 N013 0.37µ
C55 N012 0 173p
L40 N013 cheby7_15/10m_Current 0.28µ
C56 N013 0 173p
L41 N014 N015 0.37µ
C57 N014 0 80p
C58 cheby7_15/10m_new 0 80p
R17 cheby7_15/10m_new 0 50
V17 N014 0 AC 1 Rser=50
L42 N015 N016 0.47µ
C59 N015 0 173p
L43 N016 cheby7_15/10m_new 0.37µ
C60 N016 0 173p
L44 N017 N018 0.17µ
C61 NC_01 0 80p
C62 NC_02 0 80p
R18 26pql 0 50
V18 N017 0 AC 1 Rser=50
L45 N018 N019 0.39µ
C63 N018 0 120p
L46 N019 26pql 0.16µ
C64 N019 0 120p
.ac dec 1k 1meg 120meg
* Spherical 40m + 30m, ~20dB
* Dedicated 80m
* Dedicated 160m
* 20/17
* Dedicated 40m ~30dB
* Dedicated 15-10m
* Dedicated 6m
* 10-15 cheby 0.1dB 7
* cheby is even better than spherical and L is higher
* This and above can be very likely airwound
* Chebyschev 40m + 30m, ~24dB
* Cheby is better again but check if inductances here are easy, if not use SP
* Just use Spherical, Cheby requires more inductance so three large toroids - not enough space on PCB and SP gives more than 30 dB anyway
* Dedicated 160m
* 0.37u - 8 turns 0.47u -9 turns t94-10
* 0.37u - 8 turns is precise, 0.47 is not make 0.47u air wound?
* current+new caps
.backanno
.end